# EasyEDA schematic SCH_4S-modular-BMS-PCB-MK.2_2025-12-25.json
TITLE: Sheet_1; REV: 1.0; Date: 2025-12-22; Sheet: 1/1; Drawn By: hjalte; Company: Your Company
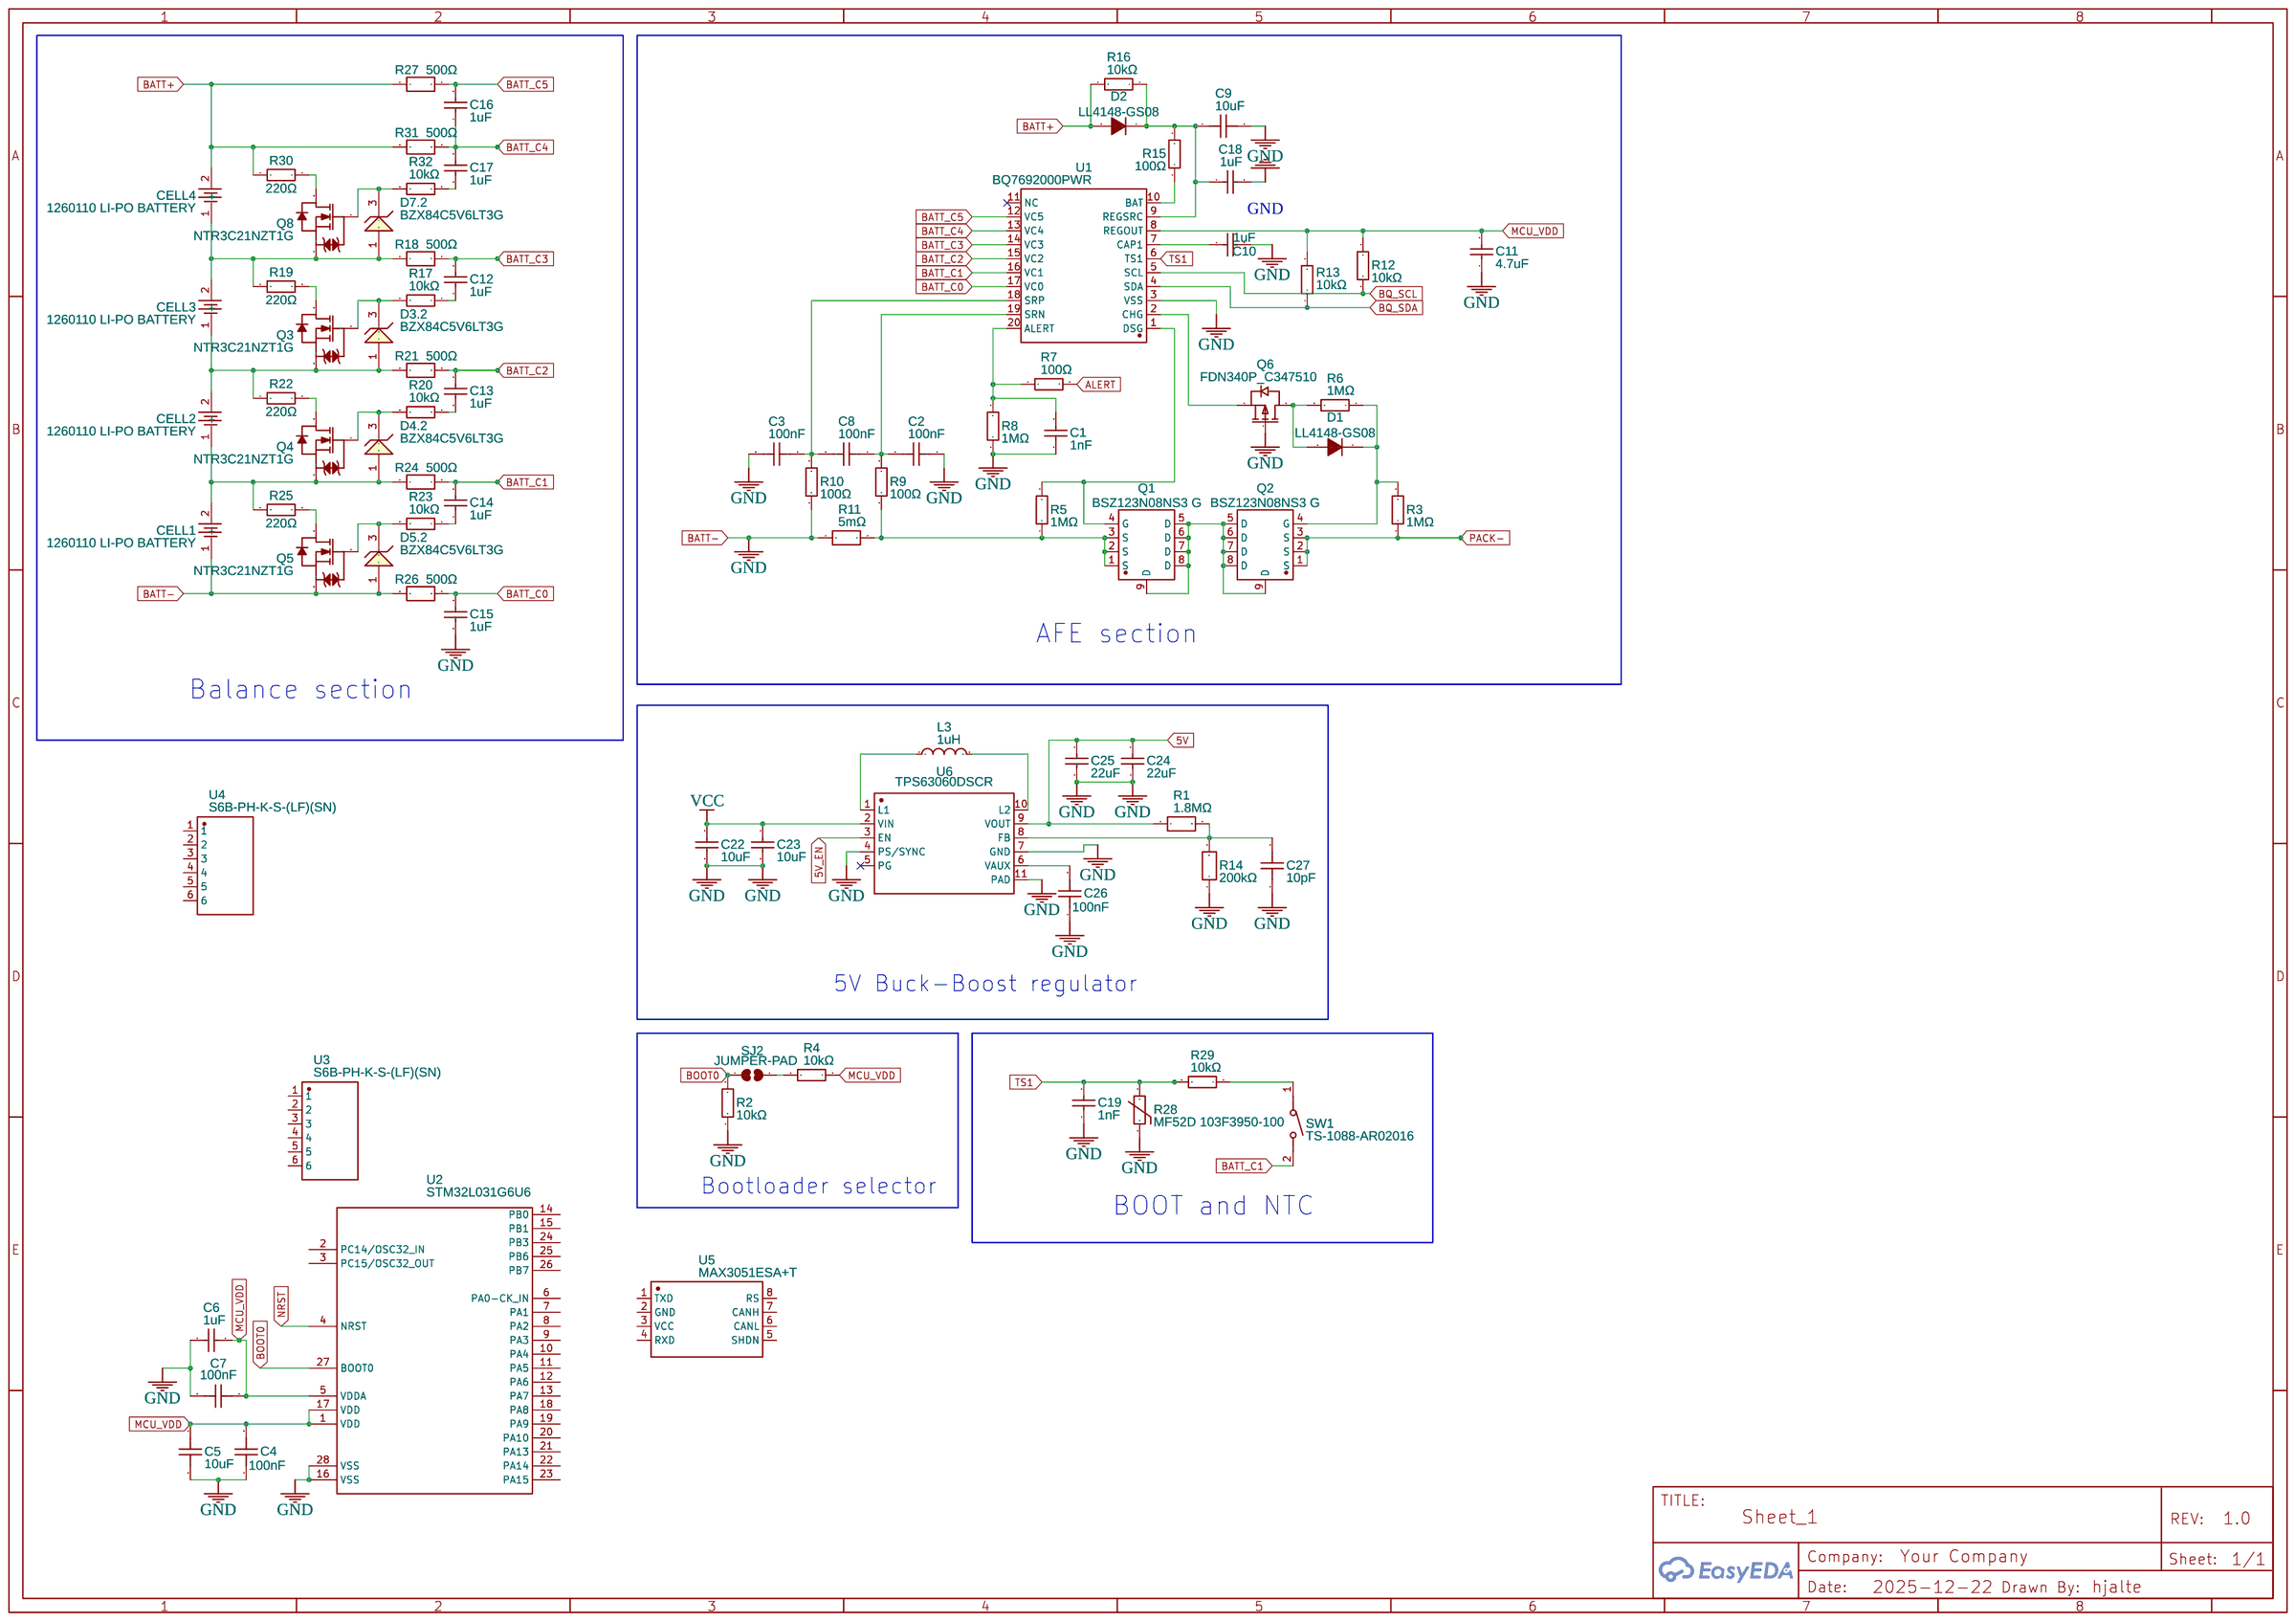
[diagram p0: schematic sheet]

## Parts
C1  1nF  [C0603]
C2  100nF  [C0402]
C3  100nF  [C0402]
C4  100nF  [C0402]
C5  10uF  [C0402]
C6  1uF  [C0603]
C7  100nF  [C0402]
C8  100nF  [C0402]
C9  10uF  [C0603]
C10  1uF  [C0603]
C11  4.7uF  [C0603]
C12  1uF  [C0603]
C13  1uF  [C0603]
C14  1uF  [C0603]
C15  1uF  [C0603]
C16  1uF  [C0603]
C17  1uF  [C0603]
C18  1uF  [C0603]
C19  1nF  [C0603]
C22  10uF  [C0805]
C23  10uF  [C0805]
C24  22uF  [C0805]
C25  22uF  [C0805]
C26  100nF  [C0402]
C27  10pF  [C0402]
CELL1  1260110 LI-PO BATTERY  [1260110 FOOTPRINT]
CELL2  1260110 LI-PO BATTERY  [1260110 FOOTPRINT]
CELL3  1260110 LI-PO BATTERY  [1260110 FOOTPRINT]
CELL4  1260110 LI-PO BATTERY  [1260110 FOOTPRINT]
D1  LL4148-GS08  [SOD-80_L3.5-W1.5-RD]
D2  LL4148-GS08  [SOD-80_L3.5-W1.5-RD]
D3  BZX84C5V6LT3G  [SOT23-3]  (section 2)
D4  BZX84C5V6LT3G  [SOT23-3]  (section 2)
D5  BZX84C5V6LT3G  [SOT23-3]  (section 2)
D7  BZX84C5V6LT3G  [SOT23-3]  (section 2)
L3  1uH  [IND-SMD_L4.5-W4.1_GSSM0420]
Q1  BSZ123N08NS3 G  [PG-TSDSON-8_L3.3-W3.3-P0.65-BL]
Q2  BSZ123N08NS3 G  [PG-TSDSON-8_L3.3-W3.3-P0.65-BL]
Q3  NTR3C21NZT1G  [SOT-23-3_L2.9-W1.6-P1.90-LS2.8-BR]
Q4  NTR3C21NZT1G  [SOT-23-3_L2.9-W1.6-P1.90-LS2.8-BR]
Q5  NTR3C21NZT1G  [SOT-23-3_L2.9-W1.6-P1.90-LS2.8-BR]
Q6  FDN340P_C347510  [SOT-23-3_L2.9-W1.3-P1.90-LS2.4-BR]
Q8  NTR3C21NZT1G  [SOT-23-3_L2.9-W1.6-P1.90-LS2.8-BR]
R1  1.8MΩ  [R0603]
R2  10kΩ  [R0603]
R3  1MΩ  [R0603]
R4  10kΩ  [R0603]
R5  1MΩ  [R0603]
R6  1MΩ  [R0603]
R7  100Ω  [R0603]
R8  1MΩ  [R0603]
R9  100Ω  [R0603]
R10  100Ω  [R0603]
R11  5mΩ  [R2512]
R12  10kΩ  [R0603]
R13  10kΩ  [R0603]
R14  200kΩ  [R0805]
R15  100Ω  [R0805]
R16  10kΩ  [R0603]
R17  10kΩ  [R0603]
R18  500Ω  [R0805]
R19  220Ω  [R0805]
R20  10kΩ  [R0603]
R21  500Ω  [R0805]
R22  220Ω  [R0805]
R23  10kΩ  [R0603]
R24  500Ω  [R0805]
R25  220Ω  [R0805]
R26  500Ω  [R0805]
R27  500Ω  [R0805]
R28  MF52D 103F3950-100  [RES-TH_BD3.0-P2.00-D0.3]
R29  10kΩ  [R0603]
R30  220Ω  [R0805]
R31  500Ω  [R0805]
R32  10kΩ  [R0603]
SJ2  JUMPER-PAD  [PAD-JUMPER-2-NO_YES_SILK]
SW1  TS-1088-AR02016  [SW-SMD_L3.9-W3.0-P4.45]
U1  BQ7692000PWR  [TSSOP-20_L6.5-W4.4-P0.65-LS6.4-BL]
U2  STM32L031G6U6  [UFQFPN-28_L4.0-W4.0-P0.50-BL]
U3  S6B-PH-K-S-(LF)(SN)  [CONN-TH_6P-P2.00_S6B-PH-K-S-LF-SN]
U4  S6B-PH-K-S-(LF)(SN)  [CONN-TH_6P-P2.00_S6B-PH-K-S-LF-SN]
U5  MAX3051ESA+T  [SOIC-8_L4.9-W3.9-P1.27-LS6.0-BL]
U6  TPS63060DSCR  [WSON-10_L3.0-W3.0-P0.50-BL-EP-A]

## Library data of the parts
C1 C19 = CC0603KRX7R9BB102: Supplier: LCSC; Manufacturer: YAGEO(国巨); Supplier Part: C100040; JLCPCB Part Class: Extended Part
C2-C4 C7 C8 C26 = CL05B104KP5NNNC: Contributor: LCSC; Supplier: LCSC; Supplier Part: C133086; Manufacturer: SAMSUNG(三星); JLCPCB Part Class: Extended Part; Package Display: No
C5 = CL05A106MP5NUNC_C315248: Contributor: LCSC; Supplier: LCSC; Supplier Part: C315248; Manufacturer: SAMSUNG(三星); Manufacturer Part: CL05A106MP5NUNC; JLCPCB Part Class: Extended Part
C6 C10 C12-C18 = CL10A105KO8NNNC: Supplier: LCSC; Manufacturer: SAMSUNG(三星); Supplier Part: C1592; JLCPCB Part Class: Extended Part
C9 = CL10A106KP8NNNC: Supplier: LCSC; Manufacturer: SAMSUNG(三星); Supplier Part: C19702; JLCPCB Part Class: Basic Part
C11 = CL10A475KP8NNNC: Supplier: LCSC; Manufacturer: SAMSUNG(三星); Supplier Part: C1705; JLCPCB Part Class: Extended Part
C22 C23 = CL21A106KOQNNNE: Supplier: LCSC; Manufacturer: SAMSUNG(三星); Supplier Part: C1713; JLCPCB Part Class: Extended Part
C24 C25 = CL21A226MOQNNNE: Supplier: LCSC; Manufacturer: SAMSUNG(三星); Supplier Part: C98190; JLCPCB Part Class: Extended Part
C27 = CL05C100JB5NNNC: Supplier: LCSC; Manufacturer: SAMSUNG(三星); Supplier Part: C32949; JLCPCB Part Class: Basic Part
CELL1-CELL4 = 1260110 LI-PO BATTERY: Contributor: lcsc
D1 D2 = LL4148-GS08: Supplier: LCSC; Manufacturer: VISHAY(威世); Supplier Part: C68883; JLCPCB Part Class: Extended Part
D3-D5 D7 = BZX84C5V6LT3G: Zener Voltage Regulator, 225 mW, 3-Pin SOT-23, Pb-Free, Tape and Reel; subpart_no: 2
L3 = MDA4020-1R0M: Supplier: LCSC; Supplier Part: C2847468; Manufacturer: KOHERelec(科或); JLCPCB Part Class: Extended Part; Contributor: lcsc
Q1 Q2 = BSZ123N08NS3 G: Contributor: LCSC; Supplier: LCSC; Supplier Part: C152364; Manufacturer: Infineon(英飞凌); Manufacturer Part: BSZ123N08NS3G; JLCPCB Part Class: Extended Part
Q3-Q5 Q8 = NTR3C21NZT1G_C5123937: Contributor: lcsc; Supplier: LCSC; Supplier Part: C5123937; Manufacturer: TECH PUBLIC(台舟); JLCPCB Part Class: Extended Part
Q6 = FDN340P_C347510: Contributor: LCSC; Supplier: LCSC; Supplier Part: C347510; Manufacturer: UMW(友台半导体); Manufacturer Part: FDN340P(UMW); JLCPCB Part Class: Extended Part
R1 = FRC0603J185TS: Supplier: LCSC; Supplier Part: C2930026; Manufacturer: FOJAN(富捷); Contributor: lcsc; JLCPCB Part Class: Extended Part
R2 R4 R12 R13 R16 R17 R20 R23 R29 R32 = RC0603FR-0710KL: Supplier: LCSC; Manufacturer: YAGEO(国巨); Supplier Part: C98220; JLCPCB Part Class: Extended Part
R3 R5 R6 R8 = RC0603FR-071ML: Supplier: LCSC; Manufacturer: YAGEO(国巨); Supplier Part: C105578; JLCPCB Part Class: Extended Part
R7 R9 R10 = RC0603FR-07100RL: Supplier: LCSC; Manufacturer: YAGEO(国巨); Supplier Part: C105588; JLCPCB Part Class: Extended Part
R11 = HOLR2512-5MR-1%: Contributor: lcsc; Supplier: LCSC; Supplier Part: C2844509; Manufacturer: Milliohm(毫欧); Manufacturer Part: HoLR2512-5mR-1%; JLCPCB Part Class: Extended Part
R14 = FRC0805F2003TS: Supplier: LCSC; Supplier Part: C2907238; Manufacturer: FOJAN(富捷); JLCPCB Part Class: Extended Part; Contributor: lcsc
R15 = RC0805FR-07100RL: Supplier: LCSC; Manufacturer: YAGEO(国巨); Supplier Part: C105577; JLCPCB Part Class: Extended Part
R18 R21 R24 R26 R27 R31 = ARG05BTC5000: Supplier: LCSC; Supplier Part: C2828711; Manufacturer: Viking(光颉); Contributor: lcsc; JLCPCB Part Class: Extended Part
R19 R22 R25 R30 = 0805W8F2200T5E: Supplier: LCSC; Manufacturer: UNI-ROYAL(厚声); Supplier Part: C17557; JLCPCB Part Class: Basic Part
R28 = MF52D 103F3950-100: Contributor: lcsc; Supplier: LCSC; Supplier Part: C394024; Manufacturer: 时恒; JLCPCB Part Class: Extended Part
SJ2 = JUMPER-PAD: Contributor: hjalte
SW1 = TS-1088-AR02016: Contributor: LCSC; Supplier: LCSC; Supplier Part: C720477; Manufacturer: XUNPU(讯普); JLCPCB Part Class: Basic Part
U1 = BQ7692000PWR: Contributor: LCSC; Supplier: LCSC; Supplier Part: C2871396; Manufacturer: TI(德州仪器); JLCPCB Part Class: Extended Part
U2 = STM32L031G6U6: Voltage - Supply: 1.8V ~ 3.6V; Contributor: LCSC; Supplier: LCSC; Manufacturer: ST(意法半导体); Supplier Part: C96514; JLCPCB Part Class: Extended Part
U3 U4 = S6B-PH-K-S-(LF)(SN): Contributor: LCSC; Supplier: LCSC; Supplier Part: C157920; Manufacturer: JST; Manufacturer Part: S6B-PH-K-S(LF)(SN); JLCPCB Part Class: Extended Part
U5 = MAX3051ESA+T: Supplier: LCSC; Manufacturer: ADI(亚德诺)/MAXIM(美信); Supplier Part: C15648; JLCPCB Part Class: Extended Part
U6 = TPS63060DSCR: Supplier: LCSC; Manufacturer: TI(德州仪器); Supplier Part: C48567; JLCPCB Part Class: Extended Part

## Nets
5V: C24.2 C25.2 R1.1 U6.9(VOUT)
5V_EN: U6.3(EN)
VCC: C22.2 C23.2 U6.2(VIN)
ALERT: R7.2
BATT+: CELL4.2(+) D2.2(A) R16.2 R27.1 R30.1 R31.1
BATT-: C1.1 C2.1 C3.2 C4.1 C5.1 C6.1 C7.2 C9.2 C10.2 C11.1 C15.1 C18.2 C19.1 C22.1 C23.1 C24.1 C25.1 C26.1 C27.1 CELL1.1(-) D5.1(A) Q5.2(S) Q6.1(G) R2.1 R8.1 R10.1 R11.1 R14.1 R26.1 R28.1 U1.3(VSS) U2.16(VSS) U2.28(VSS) U6.4(PS/SYNC) U6.7(GND) U6.11(PAD)
BATT_C0: C15.2 R26.2 U1.17(VC0)
BATT_C1: C14.2 R24.2 SW1.2 U1.16(VC1)
BATT_C2: C13.2 R21.2 U1.15(VC2)
BATT_C3: C12.2 R18.2 U1.14(VC3)
BATT_C4: C16.1 C17.2 R31.2 U1.13(VC4)
BATT_C5: C16.2 R27.2 U1.12(VC5)
BOOT0: R2.2 SJ2.1 U2.27(BOOT0)
BQ_SCL: R12.1 U1.5(SCL)
BQ_SDA: R13.1 U1.4(SDA)
MCU_VDD: C4.2 C5.2 C6.2 C7.1 C11.2 R4.1 R12.2 R13.2 U1.8(REGOUT) U2.1(VDD) U2.5(VDDA) U2.17(VDD)
NRST: U2.4(NRST)
PACK-: Q2.1(S) Q2.2(S) Q2.3(S) R3.1
TS1: C19.2 R28.2 R29.2 U1.6(TS1)
Net-(C1-2): C1.2 R7.1 R8.2 U1.20(ALERT)
Net-(C2-2): C2.2 C8.1 R9.2 U1.19(SRN)
Net-(C3-1): C3.1 C8.2 R10.2 U1.18(SRP)
Net-(C9-1): C9.1 C18.1 D2.1(C) R15.2 R16.1 U1.9(REGSRC)
Net-(C10-1): C10.1 U1.7(CAP1)
Net-(C12-1): C12.1 R17.1
Net-(C13-1): C13.1 R20.1
Net-(C14-1): C14.1 R23.1
Net-(C17-1): C17.1 R32.1
Net-(C26-2): C26.2 U6.6(VAUX)
Net-(C27-2): C27.2 R1.2 R14.2 U6.8(FB)
Net-(CELL1-2): CELL1.2(+) CELL2.1(-) D4.1(A) Q4.2(S) R24.1 R25.1
Net-(CELL2-2): CELL2.2(+) CELL3.1(-) D3.1(A) Q3.2(S) R21.1 R22.1
Net-(CELL3-2): CELL3.2(+) CELL4.1(-) D7.1(A) Q8.2(S) R18.1 R19.1
Net-(D1-1): D1.1(C) Q2.4(G) R3.2 R6.1
Net-(D1-2): D1.2(A) Q6.3(D) R6.2
Net-(D3.2-3): D3.3(K) Q3.1(G) R17.2
Net-(D4.2-3): D4.3(K) Q4.1(G) R20.2
Net-(D5.2-3): D5.3(K) Q5.1(G) R23.2
Net-(D7.2-3): D7.3(K) Q8.1(G) R32.2
Net-(L3-1): L3.1 U6.1(L1)
Net-(L3-2): L3.2 U6.10(L2)
Net-(Q1-1): Q1.1(S) Q1.2(S) Q1.3(S) R5.1 R9.1 R11.2
Net-(Q1-4): Q1.4(G) R5.2 U1.1(DSG)
Net-(Q1-5): Q1.5(D) Q1.6(D) Q1.7(D) Q1.8(D) Q1.9(D) Q2.5(D) Q2.6(D) Q2.7(D) Q2.8(D) Q2.9(D)
Net-(Q3-3): Q3.3(D) R19.2
Net-(Q4-3): Q4.3(D) R22.2
Net-(Q5-3): Q5.3(D) R25.2
Net-(Q6-2): Q6.2(S) U1.2(CHG)
Net-(Q8-3): Q8.3(D) R30.2
Net-(R4-2): R4.2 SJ2.2
Net-(R15-1): R15.1 U1.10(BAT)
Net-(R29-1): R29.1 SW1.1

Not connected (* = marked no-connect by the designer): U1 11(NC)*; U2 2(PC14/OSC32_IN) 3(PC15/OSC32_OUT) 6(PA0-CK_IN) 7(PA1) 8(PA2) 9(PA3) 10(PA4) 11(PA5) 12(PA6) 13(PA7) 14(PB0) 15(PB1) 18(PA8) 19(PA9) 20(PA10) 21(PA13) 22(PA14) 23(PA15) 24(PB3) 25(PB6) 26(PB7); U3 1 2 3 4 5 6; U4 1 2 3 4 5 6; U5 1(TXD) 2(GND) 3(VCC) 4(RXD) 5(SHDN) 6(CANL) 7(CANH) 8(RS); U6 5(PG)*

## Notes on the sheet
- AFE section
- Balance section
- 5V Buck-Boost regulator
- Bootloader selector
- BOOT and NTC
